# Altium schematic sheet 06_PFI_Buffer.SchDoc
size A3
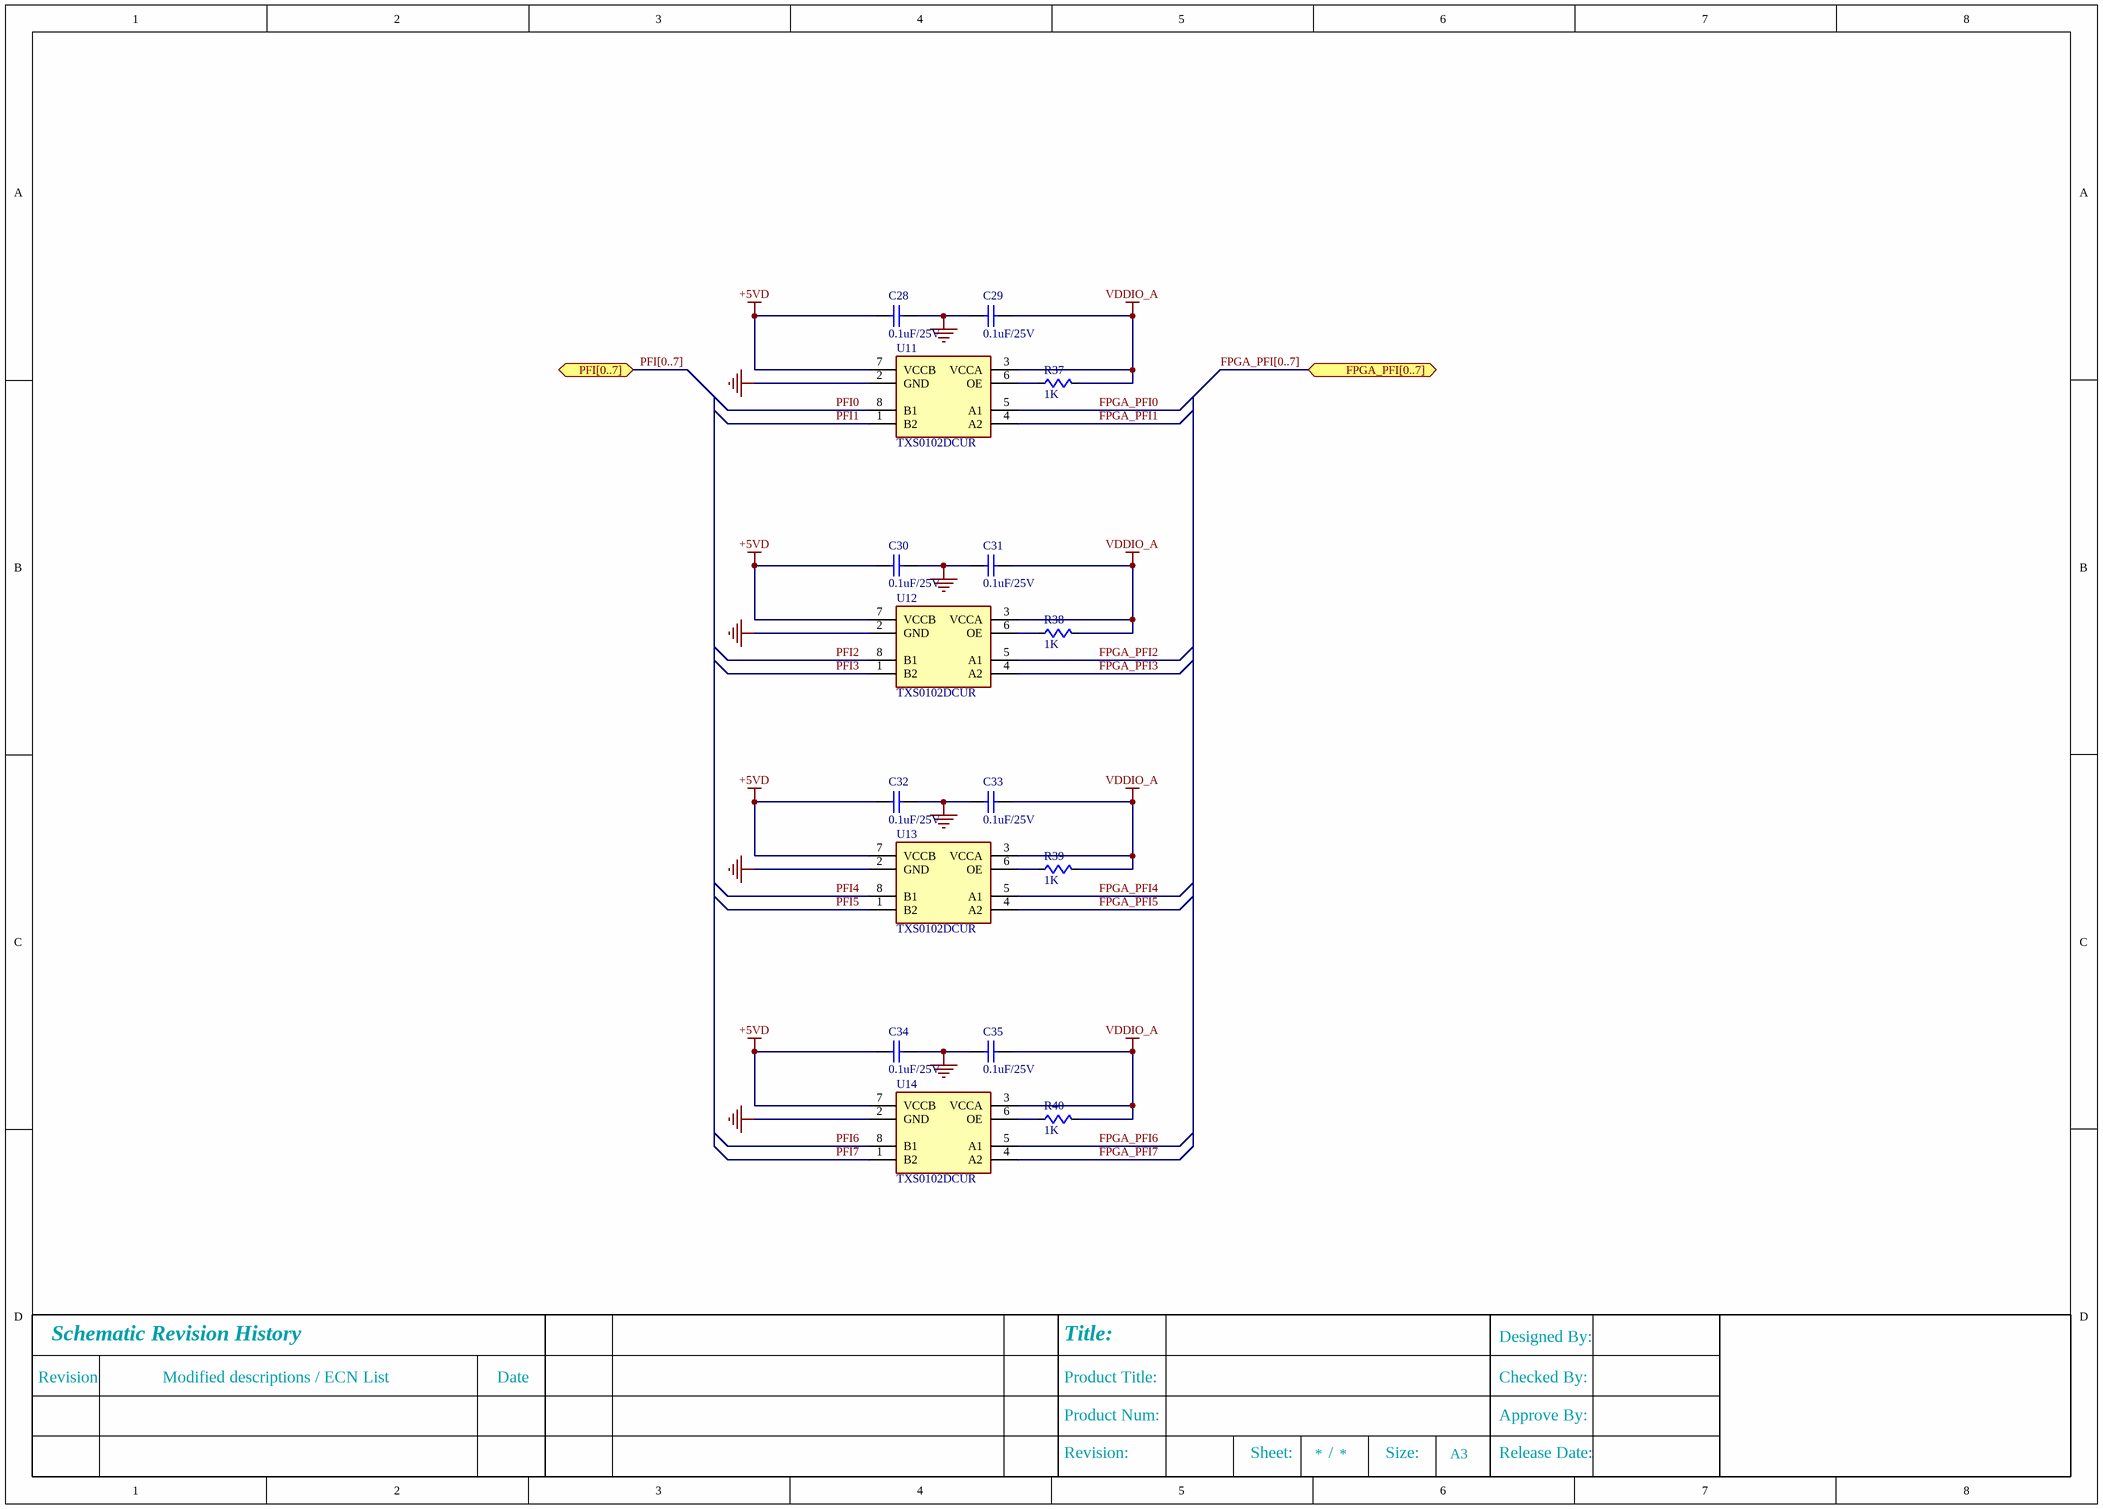
[diagram p0: 06_PFI_Buffer.SchDoc]

## Parts
C28  0.1uF/25V  [C0603]
C29  0.1uF/25V  [C0603]
C30  0.1uF/25V  [C0603]
C31  0.1uF/25V  [C0603]
C32  0.1uF/25V  [C0603]
C33  0.1uF/25V  [C0603]
C34  0.1uF/25V  [C0603]
C35  0.1uF/25V  [C0603]
R37  1K  [R0603]
R38  1K  [R0603]
R39  1K  [R0603]
R40  1K  [R0603]
U11  TXS0102DCUR  [SOP50P310X90-8N]
U12  TXS0102DCUR  [SOP50P310X90-8N]
U13  TXS0102DCUR  [SOP50P310X90-8N]
U14  TXS0102DCUR  [SOP50P310X90-8N]

## Ports
FPGA_PFI[0..7] (bidir), PFI[0..7] (bidir)

## Nets
+5VD: C28.1 C30.1 C32.1 C34.1 U11.7(VCCB) U12.7(VCCB) U13.7(VCCB) U14.7(VCCB)
GND: C28.2 C29.1 C30.2 C31.1 C32.2 C33.1 C34.2 C35.1 U11.2(GND) U12.2(GND) U13.2(GND) U14.2(GND)
VDDIO_A: C29.2 C31.2 C33.2 C35.2 R37.2 R38.2 R39.2 R40.2 U11.3(VCCA) U12.3(VCCA) U13.3(VCCA) U14.3(VCCA)
FPGA_PFI0: U11.5(A1)
FPGA_PFI1: U11.4(A2)
FPGA_PFI2: U12.5(A1)
FPGA_PFI3: U12.4(A2)
FPGA_PFI4: U13.5(A1)
FPGA_PFI5: U13.4(A2)
FPGA_PFI6: U14.5(A1)
FPGA_PFI7: U14.4(A2)
PFI0: U11.8(B1)
PFI1: U11.1(B2)
PFI2: U12.8(B1)
PFI3: U12.1(B2)
PFI4: U13.8(B1)
PFI5: U13.1(B2)
PFI6: U14.8(B1)
PFI7: U14.1(B2)
NetR37_1: R37.1 U11.6(OE)
NetR38_1: R38.1 U12.6(OE)
NetR39_1: R39.1 U13.6(OE)
NetR40_1: R40.1 U14.6(OE)

## Buses and harness runs
bus FPGA_PFI[0..7] = port FPGA_PFI[0..7]
bus PFI[0..7] = port PFI[0..7]

## Notes on the sheet
- Revision
- Schematic Revision History
- Modified descriptions / ECN List
- Date
- Product Title:
- Title:
- Checked By:
- Designed By:
- Revision:
- Product Num:
- Sheet:
- /
- Size:
- A3
- Approve By:
- Release Date:
- Title
- Date:
- Number:
- Time:
- Sheet
- of
- File:

## Library data of the parts
C28-C35 = C: MLCC
R37-R40 = R: 贴片电阻
U11-U14 = TXS0102DCUR: Integrated Circuit; Manufacturer_Name: Texas Instruments; Datasheet Link: https://datasheet.datasheetarchive.com/originals/distributors/SFDatasheet-7/sf-000145437.pdf; Height: 0.9mm; Manufacturer_Part_Number: TXS0102DCUR; Mouser Part Number: 595-TXS0102DCUR; Mouser Price/Stock: https://www.mouser.co.uk/ProductDetail/Texas-Instruments/TXS0102DCUR?qs=dB0LedT%252BmmBcQ3I%2Fs9XEDA%3D%3D; Arrow Part Number: TXS0102DCUR; Arrow Price/Stock: https://www.arrow.com/en/products/txs0102dcur/texas-instruments?region=nac